# Altium project Driver2_TI.PrjPcb
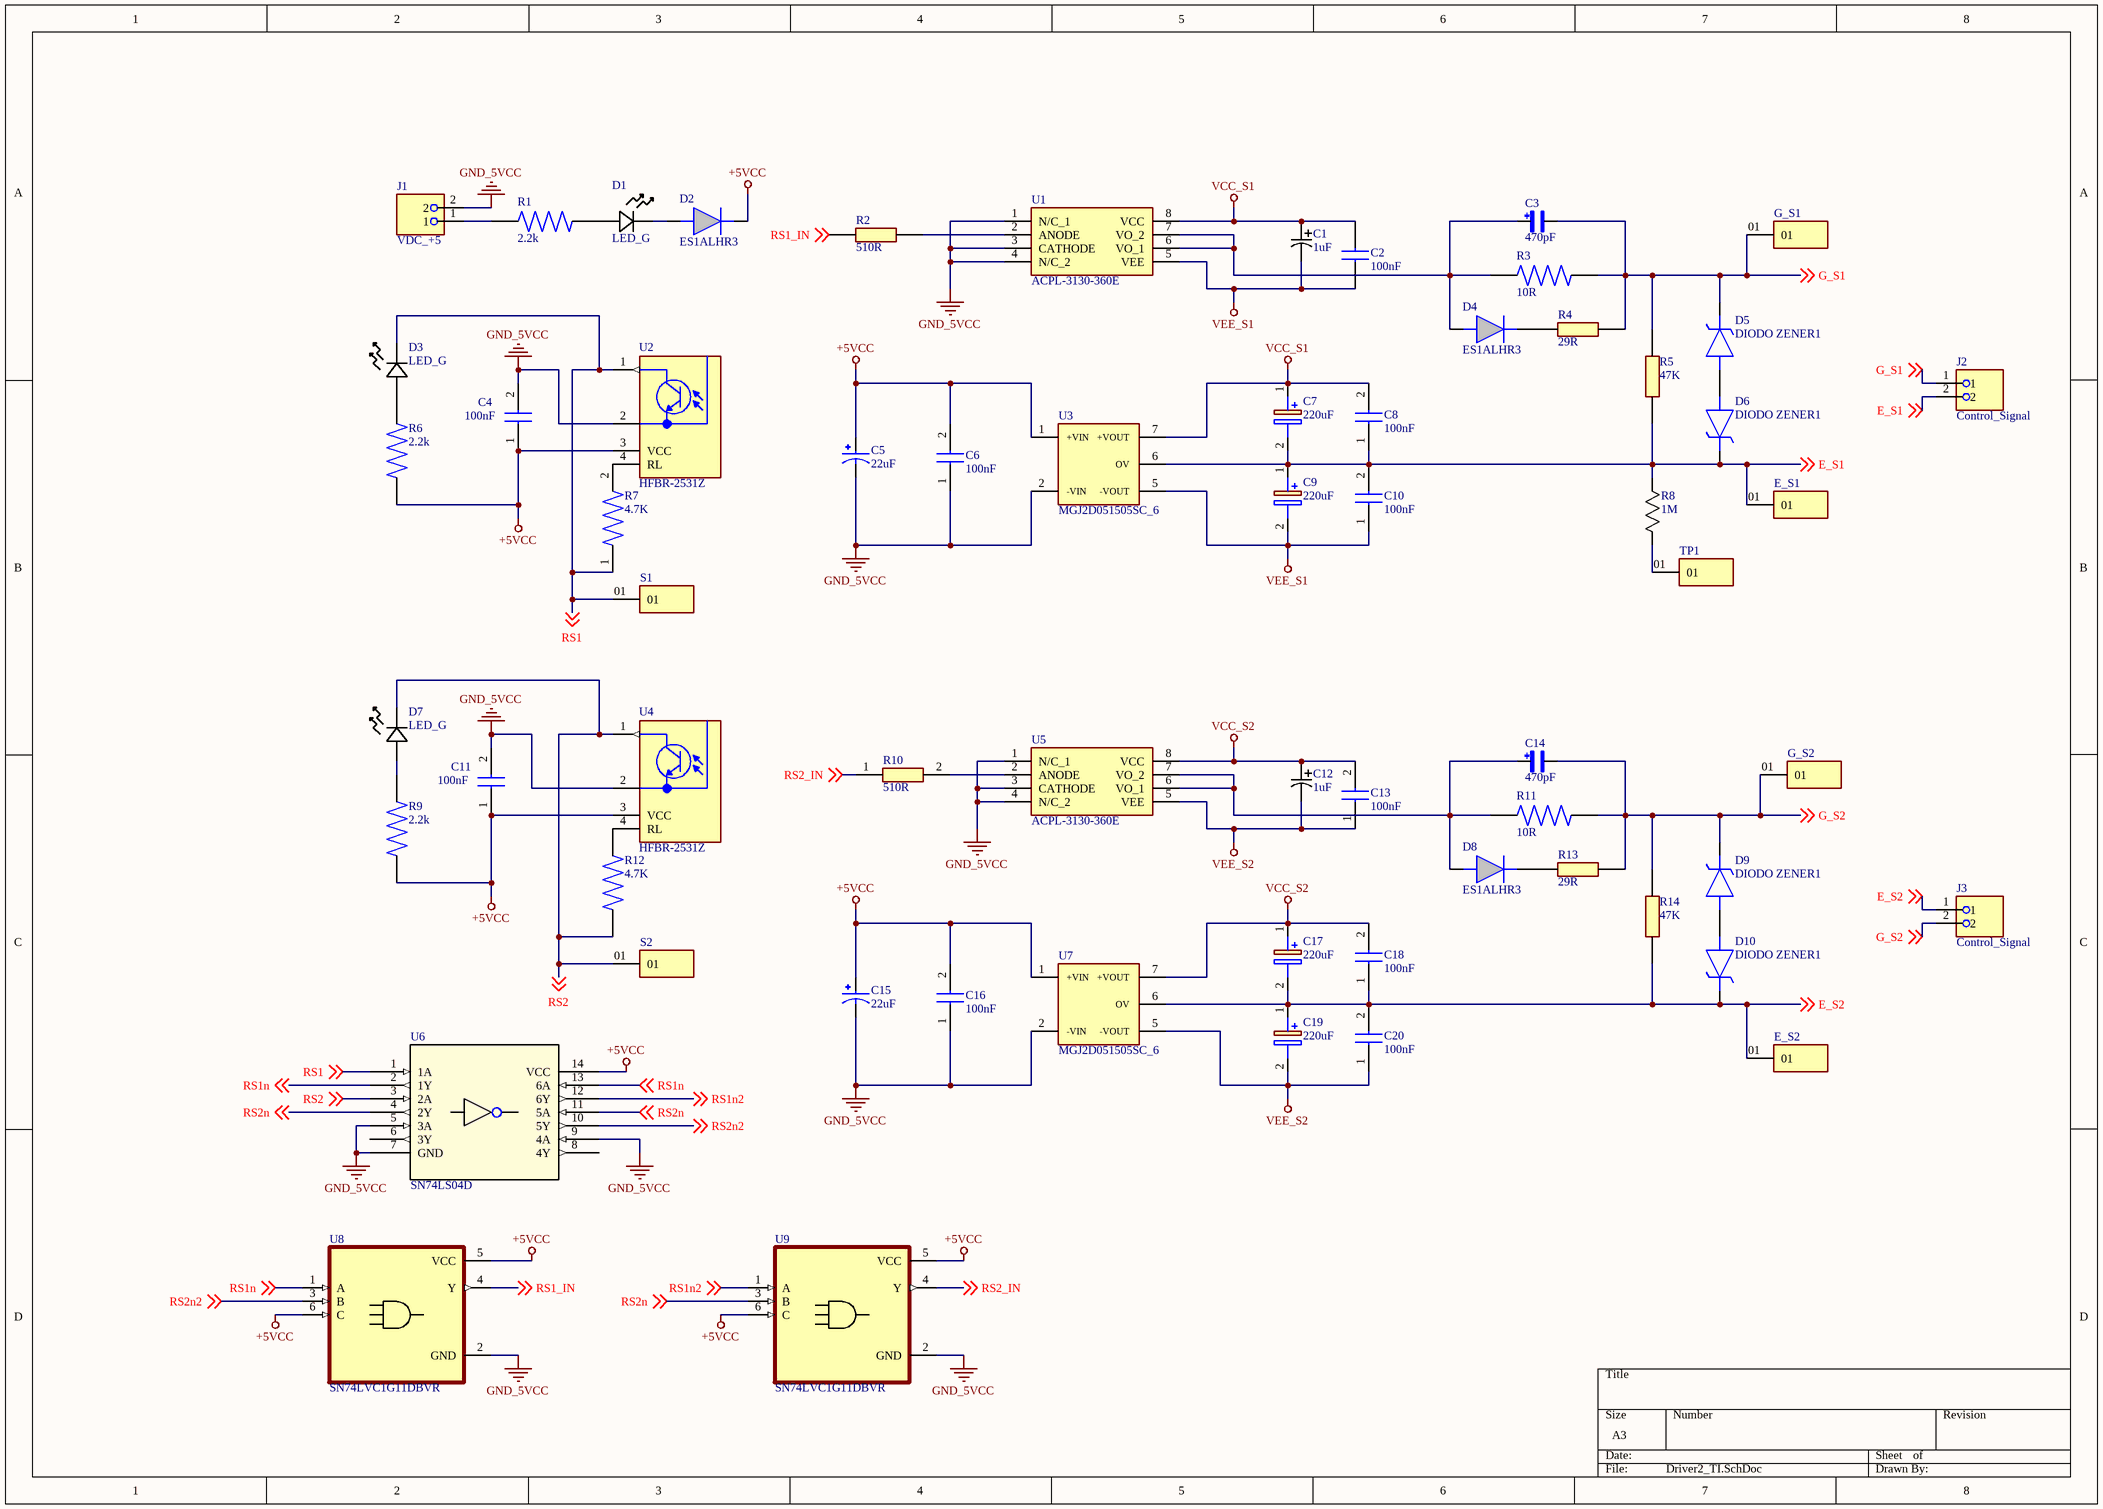
[diagram p0: Driver2_TI.SchDoc]
1 sheet, 63 parts. Net scope: global (net labels, ports and power ports of the same name join across sheets).
Board file: PCB2.PcbDoc

## Sheet Driver2_TI.SchDoc
size A3; SheetNumber: 1; SheetTotal: 1; SPICEModelCacheAKZAJUGD: <root> / <DocumentId>AKZAJUGD</DocumentId> / </root>

### Parts
C1  1uF  [CAPAE430X550N]
C2  100nF  [CAPC3216X94N]
C3  470pF  [CAPC3216X94N]
C4  100nF  [CAPC3216X94N]
C5  22uF  [CAP_EEE1HA220WP]
C6  100nF  [CAPC3216X94N]
C7  220uF  [CAPAE1050X1430N]
C8  100nF  [CAPC3216X94N]
C9  220uF  [CAPAE1050X1430N]
C10  100nF  [CAPC3216X94N]
C11  100nF  [CAPC3216X94N]
C12  1uF  [CAPAE430X550N]
C13  100nF  [CAPC3216X94N]
C14  470pF  [CAPC3216X94N]
C15  22uF  [CAP_EEE1HA220WP]
C16  100nF  [CAPC3216X94N]
C17  220uF  [CAPAE1050X1430N]
C18  100nF  [CAPC3216X94N]
C19  220uF  [CAPAE1050X1430N]
C20  100nF  [CAPC3216X94N]
D1  LED_G  [LED_KP-2012_KNB]
D2  ES1ALHR3  [DIOM4427X25M]
D3  LED_G  [LED_KP-2012_KNB]
D4  ES1ALHR3  [DIOM4427X25M]
D5  DIODO ZENER1  [DIOM5436X247N]
D6  DIODO ZENER1  [DIOM5436X247N]
D7  LED_G  [LED_KP-2012_KNB]
D8  ES1ALHR3  [DIOM4427X25M]
D9  DIODO ZENER1  [DIOM5436X247N]
D10  DIODO ZENER1  [DIOM5436X247N]
E_S1  MTMM-101-X-X-S-X  [SAMTEC_MTMM-101-X-X-S-X]  (value not drawn)
E_S2  MTMM-101-X-X-S-X  [SAMTEC_MTMM-101-X-X-S-X]  (value not drawn)
G_S1  MTMM-101-X-X-S-X  [SAMTEC_MTMM-101-X-X-S-X]  (value not drawn)
G_S2  MTMM-101-X-X-S-X  [SAMTEC_MTMM-101-X-X-S-X]  (value not drawn)
J1  VDC_+5  [PHOENIX_1725656]
J2  Control_Signal  [PHOENIX_1725656]
J3  Control_Signal  [PHOENIX_1725656]
R1  2.2k  [RES_ERJS08F2201V]
R2  510R  [RESC3216X60N]
R3  10R  [RESC6331X70N]
R4  29R  [ERJ8ENF1000V]
R5  47K  [RESC3216X60N]
R6  2.2k  [RES_ERJS08F2201V]
R7  4.7K  [RESC3116X65N]
R8  1M  [RESC6331X70N]
R9  2.2k  [RES_ERJS08F2201V]
R10  510R  [RESC3216X60N]
R11  10R  [RESC6331X70N]
R12  4.7K  [RESC3116X65N]
R13  29R  [ERJ8ENF1000V]
R14  47K  [RESC3216X60N]
S1  MTMM-101-X-X-S-X  [SAMTEC_MTMM-101-X-X-S-X]  (value not drawn)
S2  MTMM-101-X-X-S-X  [SAMTEC_MTMM-101-X-X-S-X]  (value not drawn)
TP1  MTMM-101-X-X-S-X  [SAMTEC_MTMM-101-X-X-S-X]  (value not drawn)
U1  ACPL-3130-360E  [DIP794W53P254L959H508Q8N]
U2  HFBR-2531Z  [XDCR_HFBR-2531Z]
U3  MGJ2D051505SC_6  [MGJ2D051505SC]
U4  HFBR-2531Z  [XDCR_HFBR-2531Z]
U5  ACPL-3130-360E  [DIP794W53P254L959H508Q8N]
U6  SN74LS04D  [D14]
U7  MGJ2D051505SC_6  [MGJ2D051505SC]
U8  SN74LVC1G11DBVR  [SOT95P280X145-6N]
U9  SN74LVC1G11DBVR  [SOT95P280X145-6N]

### Nets
+5VCC: C4.1(C1) C5.1 C6.2(C2) C11.1(C1) C15.1 C16.2(C2) D2.1(K) R6.1 R9.1 U2.3(VCC) U3.1(+VIN) U4.3(VCC) U6.14(VCC) U7.1(+VIN) U8.5(VCC) U8.6(C) U9.5(VCC) U9.6(C)
GND_5VCC: C4.2(C2) C5.2 C6.1(C1) C11.2(C2) C15.2 C16.1(C1) J1.2 U1.1(N/C_1) U1.3(CATHODE) U1.4(N/C_2) U2.2(GROUND) U3.2(-VIN) U4.2(GROUND) U5.1(N/C_1) U5.3(CATHODE) U5.4(N/C_2) U6.5(3A) U6.7(GND) U6.9(4A) U7.2(-VIN) U8.2(GND) U9.2(GND)
VCC_S1: C1.1 C2.2(C2) C7.1(+) C8.2(C2) U1.8(VCC) U3.7(+VOUT)
VCC_S2: C12.1 C13.2(C2) C17.1(+) C18.2(C2) U5.8(VCC) U7.7(+VOUT)
VEE_S1: C1.2 C2.1(C1) C9.2(-) C10.1(C1) U1.5(VEE) U3.5(-VOUT)
VEE_S2: C12.2 C13.1(C1) C19.2(-) C20.1(C1) U5.5(VEE) U7.5(-VOUT)
E_S1: C7.2(-) C8.1(C1) C9.1(+) C10.2(C2) D6.1(K) E_S1.01 J2.2 R5.1 R8.2 U3.6(OV) ; off-sheet E_S1
E_S2: C17.2(-) C18.1(C1) C19.1(+) C20.2(C2) D10.1(K) E_S2.01 J3.1 R14.1 U7.6(OV) ; off-sheet E_S2
G_S1: C3.2 D5.1(K) G_S1.01 J2.1 R3.2 R4.2 R5.2 ; off-sheet G_S1
G_S2: C14.2 D9.1(K) G_S2.01 J3.2 R11.2 R13.2 R14.2 ; off-sheet G_S2
RS1: D3.1(CATHODE) R7.1 S1.01 U2.1(VO) U6.1(1A) ; off-sheet RS1
RS1_IN: R2.1 U8.4(Y) ; off-sheet RS1_IN
RS1n: U6.2(1Y) U6.13(6A) U8.1(A) ; off-sheet RS1n
RS1n2: U6.12(6Y) U9.1(A) ; off-sheet RS1n2
RS2: D7.1(CATHODE) R12.1 S2.01 U4.1(VO) U6.3(2A) ; off-sheet RS2
RS2_IN: R10.1 U9.4(Y) ; off-sheet RS2_IN
RS2n: U6.4(2Y) U6.11(5A) U9.3(B) ; off-sheet RS2n
RS2n2: U6.10(5Y) U8.3(B) ; off-sheet RS2n2
NetC3_1: C3.1 D4.2(A) R3.1 U1.6(VO_1) U1.7(VO_2)
NetC14_1: C14.1 D8.2(A) R11.1 U5.6(VO_1) U5.7(VO_2)
NetD1_1: D1.1(CATHODE) D2.2(A)
NetD1_2: D1.2(ANODE) R1.2
NetD3_2: D3.2(ANODE) R6.2
NetD4_1: D4.1(K) R4.1
NetD5_2: D5.2(A) D6.2(A)
NetD7_2: D7.2(ANODE) R9.2
NetD8_1: D8.1(K) R13.1
NetD9_2: D9.2(A) D10.2(A)
NetJ1_1: J1.1 R1.1
NetR2_2: R2.2 U1.2(ANODE)
NetR7_2: R7.2 U2.4(RL)
NetR8_1: R8.1 TP1.01
NetR10_2: R10.2 U5.2(ANODE)
NetR12_2: R12.2 U4.4(RL)

Not connected (* = marked no-connect by the designer): U6 6(3Y) 8(4Y)

### Library data of the parts
C1 C12 = UWX1H010MCL1GB: Capacitor 1uF; Mfr_Name: Nichicon
C2 C4 C6 C8 C10 C11 C13 C16 C18 C20 = 12063C104MAT2A: Capacitor; Manufacturer_Name: Kyocera AVX; Manufacturer_Part_Number: 12063C104MAT2A; Mouser Part Number: 581-12063C104MAT2A; Mouser Price/Stock: https://www.mouser.co.uk/ProductDetail/KYOCERA-AVX/12063C104MAT2A?qs=m0JgOP0RQqUryqdkhb8UmQ%3D%3D; Arrow Part Number: 12063C104MAT2A; Arrow Price/Stock: https://www.arrow.com/en/products/12063c104mat2a/avx
C3 C14 = MC1206N471J101CT: Cap Ceramic 470pF 100V C0G 5% Pad SMD 1206 125Â°C T/R; MF: KYOCERA AVX Components; MP: 12061A471JAT2A; SnapEDA_Link: https://www.snapeda.com/parts/12061A471JAT2A/Kyocera/view-part/?ref=snap; Package: 3216 AVX; Value: *; Check_prices: https://www.snapeda.com/parts/12061A471JAT2A/Kyocera/view-part/?ref=eda
C5 C15 = EEE1HA220WP: 22ÂµF 50V Aluminum Electrolytic Capacitors Radial, Can - SMD 1000 Hrs @ 85Â°C; MF: Panasonic; SnapEDA_Link: https://www.snapeda.com/parts/EEE1HA220WP/Panasonic/view-part/?ref=snap; Package: RADIAL-2 Panasonic; Value: *; MP: EEE1HA220WP; Digi-Key_Part_Number: PCE3920TR-ND; Check_prices: https://www.snapeda.com/parts/EEE1HA220WP/Panasonic/view-part/?ref=eda
C7 C9 C17 C19 = MAL215097102E3: Capacitor Polarised; Manufacturer_Name: Vishay; Datasheet Link: https://www.vishay.com/docs/28395/150crz.pdf; Height: 14.3mm; Manufacturer_Part_Number: MAL215097102E3; Mouser Part Number: 594-MAL215097102E3; Mouser Price/Stock: https://www.mouser.co.uk/ProductDetail/Vishay-BC-Components/MAL215097102E3?qs=qmStTZH4TznNa7zgwdGJWg%3D%3D; Arrow Part Number: MAL215097102E3; Arrow Price/Stock: https://www.arrow.com/en/products/mal215097102e3/vishay?region=europe
D1 D3 D7 = KP-2012SGC: Manufacturer_Name: Kingbright; Type: LED Indication; Copyright: Copyright (C) 2025 Ultra Librarian. All rights reserved.; Manufacturer_Part_Number: KP-2012SGC
D2 D4 D8 = ES1ALHR3_1: Rectifiers 1A, 50V, SUPER FAST SM RECTIFIER; Manufacturer_Name: Taiwan Semiconductor; Geometry.Height: 1.43mm; Manufacturer_Part_Number: ES1ALHR3; Mouser Part Number: 821-ES1ALHR3; Mouser Price/Stock: https://www.mouser.co.uk/ProductDetail/Taiwan-Semiconductor/ES1ALHR3?qs=70cth9uAySfs%2F8RIhd19cA%3D%3D; Arrow Part Number: *; Arrow Price/Stock: *; Datasheet Link: https://componentsearchengine.com/Datasheets/1/ES1ALHR3.pdf
D5 D6 D9 D10 = 1SMB5931BT3G: Zener Diode; Manufacturer_Name: onsemi; Datasheet Link: https://www.onsemi.com/pub/Collateral/1SMB5913BT3-D.PDF; Height: 2.47mm; Manufacturer_Part_Number: 1SMB5931BT3G; Mouser Part Number: 863-1SMB5931BT3G; Mouser Price/Stock: https://www.mouser.co.uk/ProductDetail/onsemi/1SMB5931BT3G?qs=vLkC5FC1VN903PRAv1AUyg%3D%3D; Arrow Part Number: 1SMB5931BT3G; Arrow Price/Stock: https://www.arrow.com/en/products/1smb5931bt3g/on-semiconductor?region=nac
E_S1 E_S2 G_S1 G_S2 S1 S2 TP1 = MTMM-101-X-X-S-X: Connector Header Through Hole 1 position; MF: Samtec; MP: MTMM-101-05-G-S-225; SnapEDA_Link: https://www.snapeda.com/parts/MTMM-101-05-G-S-225/Samtec/view-part/?ref=snap; Package: None; Value: *; Check_prices: https://www.snapeda.com/parts/MTMM-101-05-G-S-225/Samtec/view-part/?ref=eda
J1-J3 = 1725656: Conn PC Terminal Block 2 POS 2.54mm Solder ST Thru-Hole 6A Cardboard
R1 = ERJS08F2201V: Price: None; Value: *; MP: ERJS08F2201V; Package: None; Availability: Unavailable
R2 R10 = CRCW1206510RFKEA: Resistor; Manufacturer_Name: Vishay; Datasheet Link: http://www.vishay.com/docs/20035/dcrcwe3.pdf; Height: 0.6mm; Manufacturer_Part_Number: CRCW1206510RFKEA; Mouser Part Number: 71-CRCW1206-510-E3; Mouser Price/Stock: https://www.mouser.co.uk/ProductDetail/Vishay-Dale/CRCW1206510RFKEA?qs=ZY%2FA15UmqnAPhzXgP9t8Ag%3D%3D; Arrow Part Number: CRCW1206510RFKEA; Arrow Price/Stock: https://www.arrow.com/en/products/crcw1206510rfkea/vishay?region=nac
R3 R11 = CRCW251210R0FKEGHP: 10 Ohms Â±1% 1.5W Chip Resistor 2512 (6432 Metric) Automotive AEC-Q200, Pulse Withstanding Thick Film; MF: Vishay; SnapEDA_Link: https://www.snapeda.com/parts/CRCW251210R0FKEGHP/Vishay/view-part/?ref=snap; Package: 6331 Vishay; Value: *; MP: CRCW251210R0FKEGHP; Check_prices: https://www.snapeda.com/parts/CRCW251210R0FKEGHP/Vishay/view-part/?ref=eda
R4 R13 = ERJ-8ENF30R0V: Resistor; Manufacturer_Name: Panasonic; Datasheet Link: https://industrial.panasonic.com/cdbs/www-data/pdf/RDA0000/AOA0000C86.pdf; Height: 0.7mm; Manufacturer_Part_Number: ERJ-8ENF30R0V; Mouser Part Number: 667-ERJ-8ENF30R0V; Mouser Price/Stock: https://www.mouser.co.uk/ProductDetail/Panasonic/ERJ-8ENF30R0V?qs=8%252BG0TiN%2FgVqUsQIC4%252BVXug%3D%3D; Arrow Part Number: ERJ-8ENF30R0V; Arrow Price/Stock: https://www.arrow.com/en/products/erj-8enf30r0v/panasonic?region=nac
R5 R14 = CRCW120647K0FKEA: Resistor; Manufacturer_Name: Vishay; Datasheet Link: http://www.vishay.com/docs/20035/dcrcwe3.pdf; Height: 0.6mm; Manufacturer_Part_Number: CRCW120647K0FKEA; Mouser Part Number: 71-CRCW1206-47K-E3; Mouser Price/Stock: https://www.mouser.co.uk/ProductDetail/Vishay-Dale/CRCW120647K0FKEA?qs=9sFvXT%252Bien1tefUS4L1XFw%3D%3D; Arrow Part Number: CRCW120647K0FKEA; Arrow Price/Stock: https://www.arrow.com/en/products/crcw120647k0fkea/vishay
R6 R9 = ERJS08F2201V: Resistor Film ERJS08F2201V; Price: None; Value: *; MP: ERJS08F2201V; Package: None; Availability: Unavailable
R7 R12 = CRS1206-FX-4701ELF: RES, SMD, 4.7K ohm, 0.5W, 1%, 1206, TCR100 | Bourns CRS1206-FX-4701ELF; SnapEDA_Link: https://www.snapeda.com/parts/CRS1206-FX-4701ELF/Bourns/view-part/?ref=snap; Package: 3116 Bourns; Value: *; MF: Bourns; MP: CRS1206-FX-4701ELF; Check_prices: https://www.snapeda.com/parts/CRS1206-FX-4701ELF/Bourns/view-part/?ref=eda
R8 = HV733ATTE1004F: Resistencia SMD de Tipo Chip, 1 Mohm, ± 1%, 1 W, 2512 [Métrica 6432], Película Gruesa; Mfr_Name: KOA Speer
U1 U5 = ACPL-3130-360E: Integrated Circuit; Manufacturer_Name: Avago Technologies; Datasheet Link: https://datasheet.datasheetarchive.com/originals/distributors/Datasheets-DGA20/76560.pdf; Height: 4.7mm; Manufacturer_Part_Number: ACPL-3130-360E; Mouser Part Number: 630-ACPL-3130-360E; Mouser Price/Stock: https://www.mouser.co.uk/ProductDetail/Broadcom-Avago/ACPL-3130-360E?qs=RuhU64sK2%252BvV1O6%252BbM9CBg%3D%3D
U2 U4 = HFBR-2531Z: Fiber Optic Receiver - 5MBd - 7V 10 mA; MF: Broadcom Limited; SnapEDA_Link: https://www.snapeda.com/parts/HFBR-2531Z/Broadcom+Limited/view-part/?ref=snap; Package: None; Value: *; MP: HFBR-2531Z; Check_prices: https://www.snapeda.com/parts/HFBR-2531Z/Broadcom+Limited/view-part/?ref=eda
U3 U7 = MGJ2D051505SC: Undefined or Miscellaneous; Manufacturer_Name: Murata Electronics; Datasheet Link: https://power.murata.com/datasheet?/data/power/ncl/kdc_mgj2.pdf; Height: 12mm; Manufacturer_Part_Number: MGJ2D051505SC; Mouser Part Number: 580-MGJ2D051505SC; Mouser Price/Stock: https://www.mouser.co.uk/ProductDetail/Murata-Power-Solutions/MGJ2D051505SC?qs=xLDY6iXSiQZoZsK%252BwBpeSQ%3D%3D; Arrow Part Number: MGJ2D051505SC; Arrow Price/Stock: https://www.arrow.com/en/products/mgj2d051505sc/murata-power-solutions?region=nac
U6 = SN74LS04D: Integrated Circuit; Mfr_Name: Texas Instruments; RefDes: RefDes; Type: Type
U8 U9 = SN74LVC1G11DBVR: 1-ch, 3-input 1.65-V to 5.5-V 32 mA drive strength AND gate; MF: Texas Instruments; SnapEDA_Link: https://www.snapeda.com/parts/SN74LVC1G11DBVR/Texas+Instruments/view-part/?ref=snap; Package: SOT-23-6 Texas Instruments; Value: *; MP: SN74LVC1G11DBVR; Check_prices: https://www.snapeda.com/parts/SN74LVC1G11DBVR/Texas+Instruments/view-part/?ref=eda